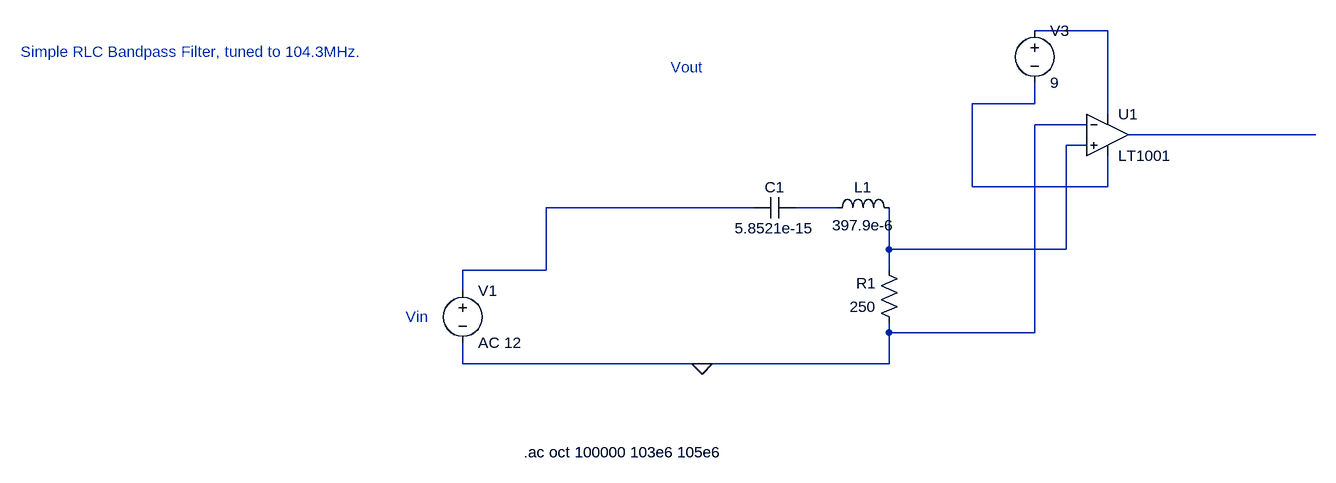
[diagram p0: schematic Radio.asc]
Radio.asc, the LTspice schematic file:
Version 4
SHEET 1 1140 680
WIRE 752 -208 640 -208
WIRE 640 -96 640 -128
WIRE 640 -96 544 -96
WIRE 752 -80 752 -208
WIRE 720 -64 640 -64
WIRE 1072 -48 784 -48
WIRE 720 -32 688 -32
WIRE 544 32 544 -96
WIRE 752 32 752 -16
WIRE 752 32 544 32
WIRE 208 64 -112 64
WIRE 336 64 272 64
WIRE 416 128 416 64
WIRE 688 128 688 -32
WIRE 688 128 416 128
WIRE -112 160 -112 64
WIRE -112 160 -240 160
WIRE 416 160 416 128
WIRE -240 192 -240 160
WIRE 416 256 416 240
WIRE 640 256 640 -64
WIRE 640 256 416 256
WIRE -240 304 -240 272
WIRE 128 304 -240 304
WIRE 416 304 416 256
WIRE 416 304 128 304
FLAG 128 304 0
SYMBOL res 432 256 R180
WINDOW 0 36 76 Left 2
WINDOW 3 36 40 Left 2
SYMATTR InstName R1
SYMATTR Value 250
SYMBOL cap 272 48 R90
WINDOW 0 0 32 VBottom 2
WINDOW 3 32 32 VTop 2
SYMATTR InstName C1
SYMATTR Value 5.8521e-15
SYMBOL ind 320 80 R270
WINDOW 0 32 56 VTop 2
WINDOW 3 5 56 VBottom 2
SYMATTR InstName L1
SYMATTR Value 397.9e-6
SYMBOL voltage -240 176 R0
WINDOW 123 24 124 Left 2
WINDOW 39 0 0 Left 2
SYMATTR InstName V1
SYMATTR Value AC 12
SYMBOL Opamps\\LT1001 752 -112 R0
SYMATTR InstName U1
SYMBOL voltage 640 -224 R0
WINDOW 123 0 0 Left 2
WINDOW 39 0 0 Left 2
SYMATTR InstName V3
SYMATTR Value 9
TEXT -146 440 Left 2 !.ac oct 100000 103e6 105e6
TEXT 80 -152 Left 2 ;Vout
TEXT -328 232 Left 2 ;Vin
TEXT -920 -176 Left 2 ;Simple RLC Bandpass Filter, tuned to 104.3MHz.

The netlist it stands for:
* Radio.asc
R1 0 N004 250
C1 N006 N005 5.8521e-15
L1 N006 N004 397.9e-6
V1 N005 0 AC 12
XU1 N004 0 N001 N002 N003 LT1001  ; pins In+ In- V+ V- OUT
V3 N001 N002 9
.ac oct 100000 103e6 105e6
* Vout
* Vin
* Simple RLC Bandpass Filter, tuned to 104.3MHz.
.lib LTC.lib
.backanno
.end